# EAGLE design tinyI2C (EAGLE 6.5.0)
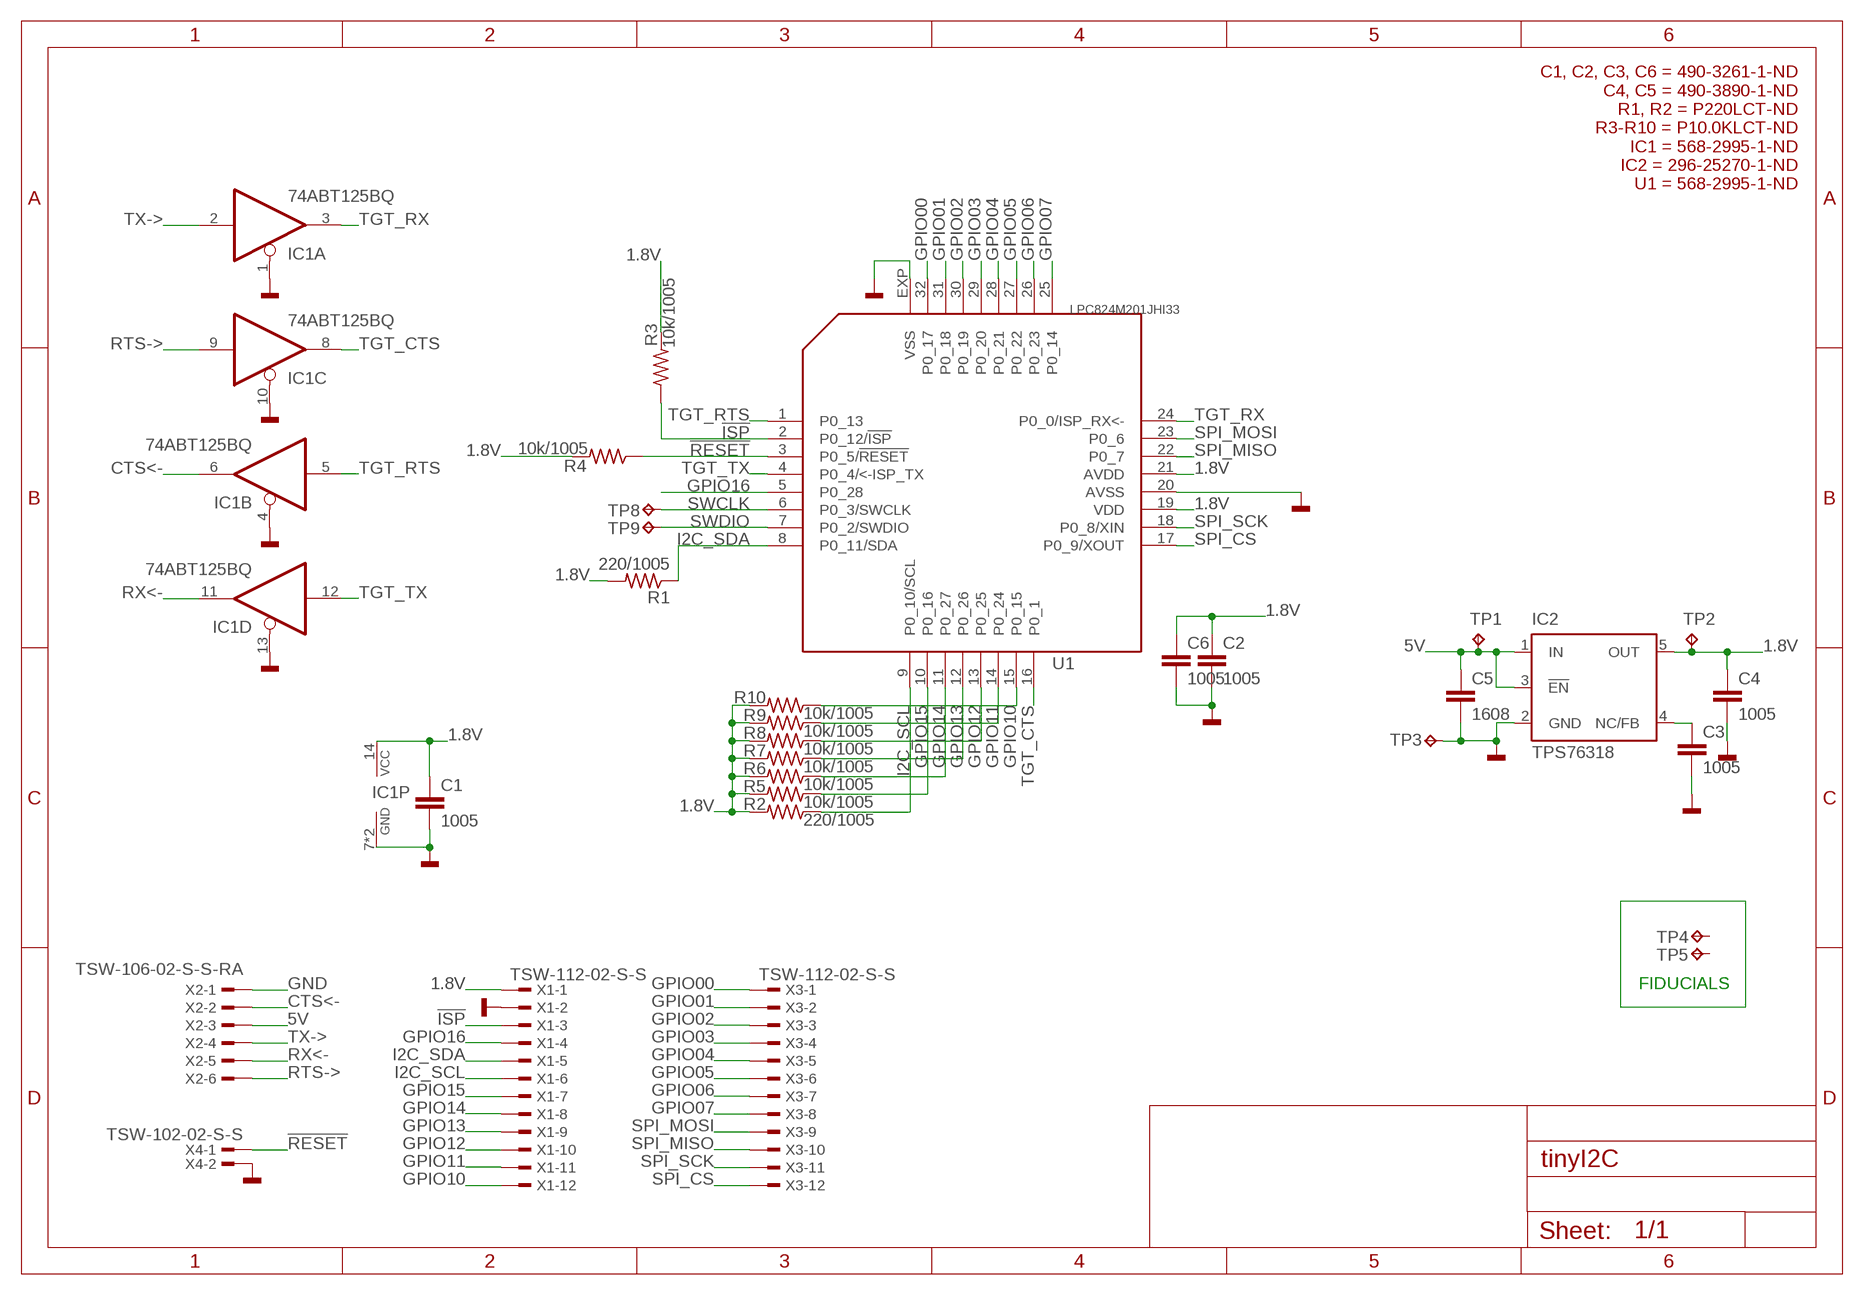
[diagram p0: schematic, sheet 1]

## Parts
C1  1005  C-EUC1005  [C1005]
C2  1005  C-EUC1005  [C1005]
C3  1005  C-EUC1005  [C1005]
C4  1005  C-EUC1005  [C1005]
C5  1608  C-EUC1608  [C1608]
C6  1005  C-EUC1005  [C1005]
IC1  74ABT125BQ  [DHVQFN14]
IC2  TPS76318  TPS77018  [SOT23-DBV]
R1  220/1005  R-US_R1005  [R1005]
R2  220/1005  R-US_R1005  [R1005]
R3  10k/1005  R-US_R1005  [R1005]
R4  10k/1005  R-US_R1005  [R1005]
R5  10k/1005  R-US_R1005  [R1005]
R6  10k/1005  R-US_R1005  [R1005]
R7  10k/1005  R-US_R1005  [R1005]
R8  10k/1005  R-US_R1005  [R1005]
R9  10k/1005  R-US_R1005  [R1005]
R10  10k/1005  R-US_R1005  [R1005]
TP1  TPTP07R  [TP07R]
TP2  TPTP07R  [TP07R]
TP3  TPTP07R  [TP07R]
TP4  TPTP10R  [TP10R]
TP5  TPTP10R  [TP10R]
TP8  TPTP07R  [TP07R]
TP9  TPTP07R  [TP07R]
U1  LPC824M201JHI33  [HVQFN33]
X1  TSW-112-02-S-S  [TSW-112-02-S-S]
X2  TSW-106-02-S-S-RA  [TSW-106-02-S-S-RA]
X3  TSW-112-02-S-S  [TSW-112-02-S-S]
X4  TSW-102-02-S-S  [TSW-102-02-S-S]

## Nets
1.8V: C1.1 C2.1 C4.1 C6.1 IC1.14(P:VCC) IC2.5(OUT) R1.2 R2.2 R3.2 R4.2 R5.2 R6.2 R7.2 R8.2 R9.2 R10.2 TP2.TP U1.19(VDD) U1.21(AVDD) X1.1
5V: C5.1 IC2.1(IN) IC2.3(!EN) TP1.TP X2.3
!ISP!: R3.1 U1.2(P0_12/!ISP!) X1.3
!RESET!: R4.1 U1.3(P0_5/!RESET!) X4.1
CTS<-: IC1.6(B:O) X2.2
GND: C1.2 C2.2 C3.2 C4.2 C5.2 C6.2 IC1.1(A:OE) IC1.4(B:OE) IC1.7(P:GND) IC1.10(C:OE) IC1.13(D:OE) IC1.EXP(P:GND) IC2.2(GND) TP3.TP U1.20(AVSS) U1.EXP(VSS) X1.2 X2.1 X4.2
GPIO00: U1.32(P0_17) X3.1
GPIO01: U1.31(P0_18) X3.2
GPIO02: U1.30(P0_19) X3.3
GPIO03: U1.29(P0_20) X3.4
GPIO04: U1.28(P0_21) X3.5
GPIO05: U1.27(P0_22) X3.6
GPIO06: U1.26(P0_23) X3.7
GPIO07: U1.25(P0_14) X3.8
GPIO10: R10.1 U1.15(P0_15) X1.12
GPIO11: R9.1 U1.14(P0_24) X1.11
GPIO12: R8.1 U1.13(P0_25) X1.10
GPIO13: R7.1 U1.12(P0_26) X1.9
GPIO14: R6.1 U1.11(P0_27) X1.8
GPIO15: R5.1 U1.10(P0_16) X1.7
GPIO16: U1.5(P0_28) X1.4
I2C_SCL: R2.1 U1.9(P0_10/SCL) X1.6
I2C_SDA: R1.1 U1.8(P0_11/SDA) X1.5
N$1: C3.1 IC2.4(NC/FB)
RTS->: IC1.9(C:I) X2.6
RX<-: IC1.11(D:O) X2.5
SPI_CS: U1.17(P0_9/XOUT) X3.12
SPI_MISO: U1.22(P0_7) X3.10
SPI_MOSI: U1.23(P0_6) X3.9
SPI_SCK: U1.18(P0_8/XIN) X3.11
SWCLK: TP8.TP U1.6(P0_3/SWCLK)
SWDIO: TP9.TP U1.7(P0_2/SWDIO)
TGT_CTS: IC1.8(C:O) U1.16(P0_1)
TGT_RTS: IC1.5(B:I) U1.1(P0_13)
TGT_RX: IC1.3(A:O) U1.24(P0_0/ISP_RX<-)
TGT_TX: IC1.12(D:I) U1.4(P0_4/<-ISP_TX)
TX->: IC1.2(A:I) X2.4
Unconnected: TP4.TP TP5.TP

## Notes on the sheet
- C1, C2, C3, C6 = 490-3261-1-ND
  C4, C5 = 490-3890-1-ND
  R1, R2 = P220LCT-ND
  R3-R10 = P10.0KLCT-ND
  IC1 = 568-2995-1-ND
  IC2 = 296-25270-1-ND
  U1 = 568-2995-1-ND
- FIDUCIALS

## Library data of the parts
C1-C6 = rcl:C-EU: CAPACITOR, European symbol
IC1 = 74xx-eu_local:74*125: Quad bus BUFFER, 3-state
IC2 = texas:TPS770*: ULTRALOW-POWER 50-mA LOW-DROPOUT LINEAR REGULATORS 50-mA Low-Dropout Regulator Source: http://focus.ti.com/lit/ds/symlink/tps77001.pdf; MF: TEXAS INSTRUMENT CONNECTORS; MPN: TPS77018DBVR; OC_FARNELL: 1575745; OC_NEWARK: 77C1176
R1-R10 = rcl:R-US_: RESISTOR, American symbol
TP1-TP5 TP8 TP9 = testpad:TP: Test pad
U1 = mbed-HDK:LPC824M201JHI33
X1 X3 = con-samtec.local:TSW-112-02-S-S: THROUGH-HOLE .025" SQ POST HEADER Source: Samtec TSW.pdf; OC_FARNELL: unknown; OC_NEWARK: unknown
X2 = con-samtec.local:TSW-106-02-S-S: THROUGH-HOLE .025" SQ POST HEADER Source: Samtec TSW.pdf; OC_FARNELL: unknown; OC_NEWARK: unknown
X4 = con-samtec.local:TSW-102-02-S-S: THROUGH-HOLE .025" SQ POST HEADER Source: Samtec TSW.pdf; OC_FARNELL: unknown; OC_NEWARK: unknown

## Net classes
0 default: clearance 0.2 mm
1 power: clearance 0.2 mm

## Board
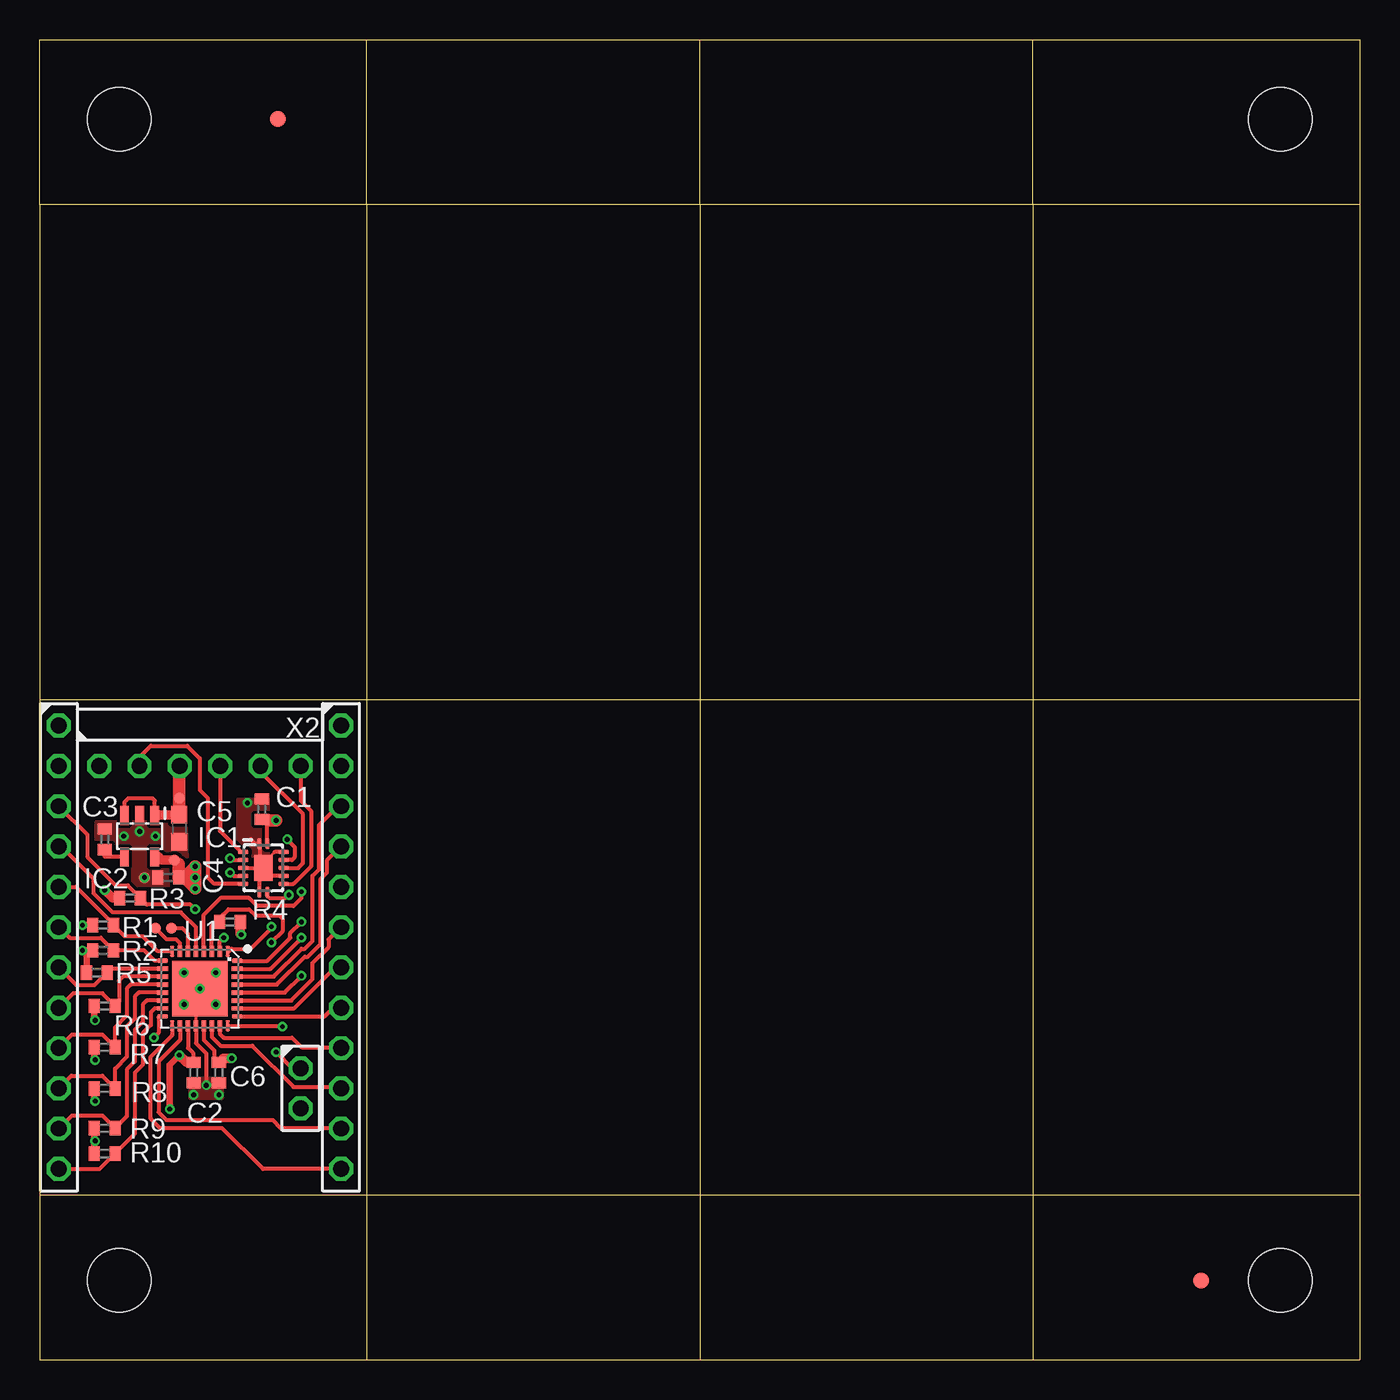
[diagram p1: board, top side]
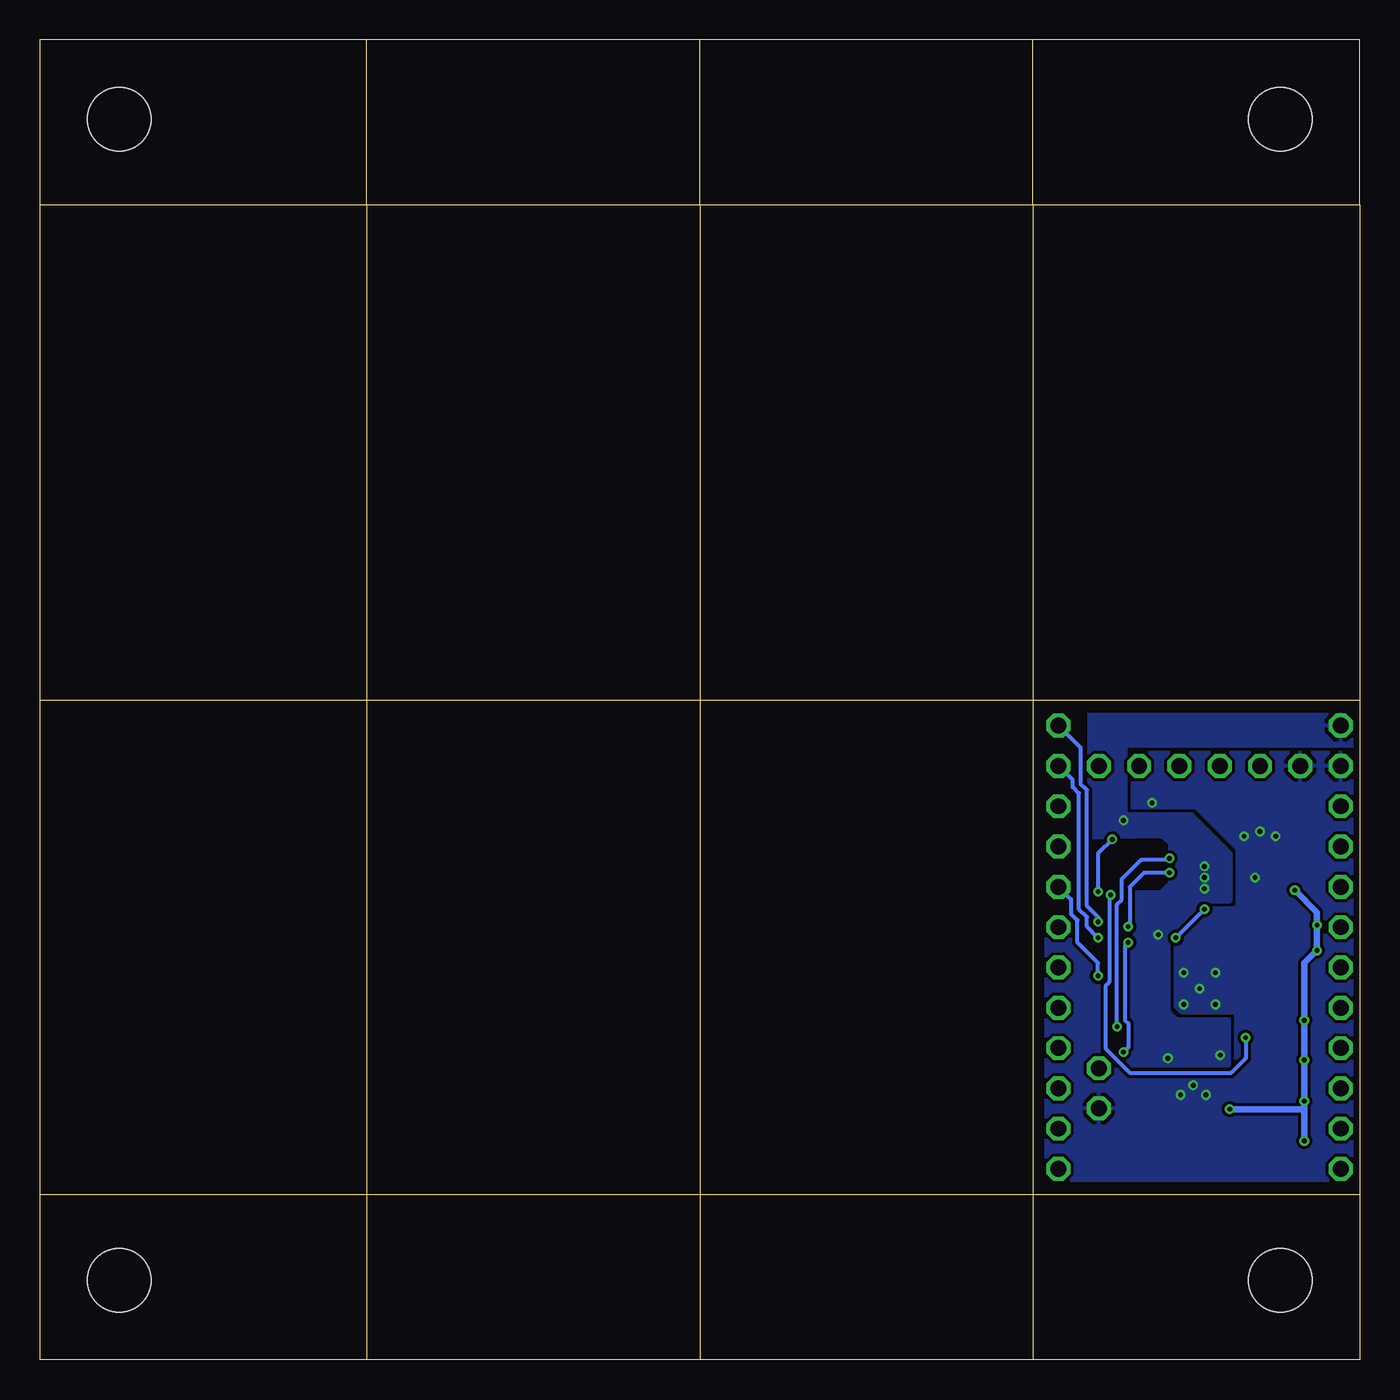
[diagram p2: board, bottom side, seen from below]

Size 83.2 x 83.2 mm. Coordinates in mm from the lower left corner, seen from the top.
Outline: 0,10.4 20.6,10.4
Outline: 20.6,10.4 41.6,10.4
Outline: 41.6,10.4 62.6,10.4
Outline: 62.6,10.4 83.2,10.4
Outline: 83.2,72.8 62.6,72.8
Outline: 62.6,72.8 41.6,72.8
Outline: 41.6,72.8 20.6,72.8
Outline: 20.6,72.8 0,72.8
Outline: 0,72.8 0,41.6
Outline: 0,41.6 0,10.4
Outline: 83.2,72.8 83.2,41.6
Outline: 83.2,41.6 83.2,10.4
Outline: 20.6,72.8 20.6,41.6
Outline: 20.6,41.6 20.6,10.4
Outline: 20.6,41.6 0,41.6
Outline: 41.6,72.8 41.6,41.6
Outline: 41.6,41.6 20.6,41.6
Outline: 41.6,41.6 41.6,10.4
Outline: 62.6,41.6 41.6,41.6
Outline: 62.6,72.8 62.6,41.6
Outline: 83.2,41.6 62.6,41.6
Outline: 62.6,41.6 62.6,10.4
Outline: 0,72.8 0,83.2 20.6,83.2
Outline: 20.6,83.2 41.6,83.2
Outline: 41.6,83.2 62.6,83.2
Outline: 62.6,83.2 83.2,83.2 83.2,72.8
Outline: 83.2,10.4 83.2,0 62.6,0
Outline: 20.6,0 0,0 0,10.4
Outline: 20.6,0 41.6,0
Outline: 41.6,0 62.6,0
Outline: 20.6,72.8 20.6,83.2
Outline: 41.6,72.8 41.6,83.2
Outline: 62.6,72.8 62.6,83.2
Outline: 62.6,10.4 62.6,0
Outline: 41.6,10.4 41.6,0
Outline: 20.6,10.4 20.6,0
Copper layers (1*16): Top 0.035mm / dielectric 1.5mm / Bottom 0.035mm
Design rules "default *": minimum track width 0.15mm, minimum drill 0.3mm, track to track 0.15mm, track to pad 0.15mm, pad to pad 0.15mm, via to via 0.15mm, smd to smd 0mil, copper to edge 0.4mm, drill to drill 8mil, minimum pad ring 0.15mm, minimum via ring 0.15mm, stop-mask expansion 4mil, vias tented up to drill 100mil, thermal gap 10mil
Holes 4 mm at 5,78.2 78.2,5 78.2,78.2 5,5
bRestrict: 4 lines

### Footprints (pad centres in the part's own frame; a part is rotated, then mirrored left to right if it is on the bottom)
C1005 = smd 0.7 x 0.9: 1 -0.65,0; 2 0.65,0
C1608 = smd 1.1 x 1: 1 -0.85,0; 2 0.85,0
DHVQFN14 = smd 0.7 x 0.28: 1 -1.525,-0.25; 7 1.525,-0.25; 8 1.525,0.25; 14 -1.525,0.25 | smd 0.28 x 0.7: 2 -1,-1.275; 3 -0.5,-1.275; 4 0,-1.275; 5 0.5,-1.275; 6 1,-1.275; 9 1,1.275; 10 0.5,1.275; 11 0,1.275; 12 -0.5,1.275; 13 -1,1.275 | smd 1.65 x 1.15: EXP 0,0
SOT23-DBV = smd 0.55 x 1.2: 1 -0.95,-1.3; 2 0,-1.3; 3 0.95,-1.3; 4 0.95,1.3; 5 -0.95,1.3
R1005 = smd 0.7 x 0.9: 1 -0.65,0; 2 0.65,0
TP07R = smd 0.7 x 0.7: TP 0,0
TP10R = smd 1 x 1: TP 0,0
HVQFN33 = smd 0.7 x 0.28: 1 -2.35,1.75; 2 -2.35,1.25; 3 -2.35,0.75; 4 -2.35,0.25; 5 -2.35,-0.25; 6 -2.35,-0.75; 7 -2.35,-1.25; 8 -2.35,-1.75; 17 2.35,-1.75; 18 2.35,-1.25; 19 2.35,-0.75; 20 2.35,-0.25; 21 2.35,0.25; 22 2.35,0.75; 23 2.35,1.25; 24 2.35,1.75 | smd 0.28 x 0.7: 9 -1.75,-2.35; 10 -1.25,-2.35; 11 -0.75,-2.35; 12 -0.25,-2.35; 13 0.25,-2.35; 14 0.75,-2.35; 15 1.25,-2.35; 16 1.75,-2.35; 25 1.75,2.35; 26 1.25,2.35; 27 0.75,2.35; 28 0.25,2.35; 29 -0.25,2.35; 30 -0.75,2.35; 31 -1.25,2.35; 32 -1.75,2.35 | smd 3.5 x 3.5: EXP 0,0
TSW-112-02-S-S = drill 1 pad 1.5 octagon: 1 13.97,0; 2 11.43,0; 3 8.89,0; 4 6.35,0; 5 3.81,0; 6 1.27,0; 7 -1.27,0; 8 -3.81,0; 9 -6.35,0; 10 -8.89,0; 11 -11.43,0; 12 -13.97,0
TSW-106-02-S-S-RA = drill 1 pad 1.5 octagon: 1 6.35,1.524; 2 3.81,1.524; 3 1.27,1.524; 4 -1.27,1.524; 5 -3.81,1.524; 6 -6.35,1.524
TSW-102-02-S-S = drill 1 pad 1.5 octagon: 1 1.27,0; 2 -1.27,0

### Placement (x,y rotation side)
C1  14,34.7 90 top
C2  9.7,18.1 270 top
C3  4.1,32.8 90 top
C4  8.1,30.4 180 top
C5  8.8,33.5 270 top
C6  11.3,18.1 270 top
IC1  14.1,31 270 top
IC2  6.3,33 180 top
R1  4,27.4 180 top
R2  4,25.8 180 top
R3  5.7,29.1 180 top
R4  12,27.6 0 top
R5  3.6,24.4 180 top
R6  4.1,22.3 180 top
R7  4.1,19.7 180 top
R8  4.1,17.1 180 top
R9  4.1,14.6 180 top
R10  4.1,13 180 top
TP1  8.8,35.4 0 top
TP2  8.5,31.5 0 top
TP3  6.6,30.4 0 top
TP4  15,78.2 0 top
TP5  73.2,5 0 top
TP8  8.3,27.2 0 top
TP9  7.3,27.2 0 top
U1  10.1,23.4 270 top
X1  1.21,26 90 top
X2  10.1,38.95 180 top
X3  18.99,26 90 top
X4  16.45,17.11 90 top

### Tracks (layer width: path | path; a pad name or v marks a point on that pad's centre or on a via)
1.8V  (via drill 0.3, 0.3 pad 0.6)
  Top 0.25: U1.21 10.35,20.15 11,19.5 11,19.05 C6.1 | U1.19 9.35,19.65 9.7,19.3 C2.1 | IC1.14 14.35,33.7 C1.1
  Top 0.4: IC2.5 7.5,31.7 | R6.2 3.45,21.45 v3.5,21.4 | R7.2 3.45,18.95 v3.5,18.9 | R8.2 3.45,16.35 v3.5,16.3 | R9.2 3.45,13.85 v3.5,13.8 3.45,13.75 R10.2 | R5.2 2.95,25.55 v2.7,25.8 R2.2 | R1.2 v2.7,27.4 | v8.2,15.8 8.2,18.6 v8.8,19.2
  Top 0.6: C4.1 9.1,30.4 | 8.75,31.25 TP2.TP 7.7,31.5 7.5,31.7 | R4.2 12.65,26.85 v12.7,26.8 | R3.2 4.6,29.1 v4.1,29.6 | v12.1,19 11.55,19 C6.1 | C2.1 9.25,18.75 v8.8,19.2 | 14.5,34 14,34 C1.1
  Top 0.8: 8.75,31.25 C4.1 | v14.9,34 14.5,34 | v9.8,31.1 v9.8,30.4 v9.8,29.7 9.1,30.4 v9.8,31.1
  Bottom 0.4: v3.5,13.8 3.5,15.8 | 3.5,15.8 v3.5,16.3 v3.5,18.9 v3.5,21.4 3.5,25 v2.7,25.8 v2.7,27.4 2.7,28.2 v4.1,29.6 | v8.2,15.8 3.5,15.8
  pour Bottom: 8.1,31.9 10.6,34.4 14.7,34.4 14.7,38.7 -0.5,38.7 -0.5,41.4 17.1,41.4 17.1,32.9 12.5,33 12,32.5 12,30.1 12.6,29.5 15,29.5 15,19 14,18 8.2,18 8.2,21.5 11.5,21.5 12,22 12,26.5 9.6,28.9 8.1,28.9
5V
  Top 0.25: IC2.1 7.25,35.25 7.1,35.4 5.6,35.4 5.35,35.15 IC2.3
  Top 0.6: C5.1 7.3,34.35 IC2.1
  Top 0.8: X2.3 8.8,36.85 TP1.TP C5.1
!ISP!  (via drill 0.3)
  Top 0.25: U1.2 11.35,26.35 v11.6,26.6 | v9.8,28.4 9.5,28.7 6.75,28.7 R3.1 5.55,29.9 4.8,29.9 3,31.7 3,33.1 X1.3
  Bottom 0.25: v11.6,26.6 v9.8,28.4
!RESET!  (via drill 0.3)
  Top 0.25: U1.3 10.85,27.35 11.1,27.6 R4.1 11.35,27.85 11.9,28.4 13.2,28.4 13.6,28 15.1,28 15.3,27.8 15.3,27 v14.6,26.3 | v14.9,19.4 15.92,18.38 X4.1
  Bottom 0.25: v14.6,26.3 14.8,26.1 14.8,21.4 14.6,21.2 14.6,19.7 v14.9,19.4
CTS<-
  Top 0.25: X2.2 6.29,37.99 7,38.7 9.3,38.7 10.1,37.9 10.1,35.9 10.6,35.4 10.6,30.4 11,30 IC1.6
GND  (via drill 0.3)
  Top 0.2: U1.20 9.85,23.15 U1.EXP | 14.8,32 14.5,31.7
  Top 0.25: 14.5,31.7 14.5,31.4 IC1.EXP | IC1.EXP 14.6,30.5 IC1.10 | U1.20 9.85,19.95 10.5,19.3 v10.5,17.3 | IC1.4 IC1.EXP | IC1.13 14.8,32 | IC1.EXP 13.85,31.25 IC1.1 13.57,32.52 13.3,32.8 | IC1.7 13.85,30.75 IC1.EXP
  other vias: 13.1,35.1 11.1,22.4 11.1,24.4 9.1,24.4 9.1,22.4 10.1,23.4 6.3,33.3 6.6,30.4 7.3,33 5.3,33 9.7,16.7 11.3,16.7
  pour Bottom (rank 2): 0,41.2 20.2,41.2 20.2,10.8 0,10.8
  pour Top (no thermals): 3.6,33.9 9.2,33.9 9.3,29.9 5.9,29.9 5.9,31.4 3.6,31.4
  pour Top (rank 2, no thermals): 9.5,17.7 9.5,16.5 11.5,16.5 11.5,17.7
  pour Top (rank 2, no thermals): 12.5,31.8 14.4,31.8 14.4,35.3 12.5,35.3
GPIO00  (via drill 0.3 pad 0.6)
  Top 0.25: U1.32 14.35,25.15 15.8,26.6 15.8,26.9 v16.5,27.6
  Bottom 0.25: v16.5,27.6 16.5,27.9 17.2,28.6 17.2,35.9 17.6,36.3 17.6,38.58 X3.1
GPIO01  (via drill 0.3)
  Top 0.25: U1.31 14.55,24.65 v16.5,26.6
  Bottom 0.25: v16.5,26.6 17.2,27.3 17.2,27.9 17.7,28.4 17.7,35.7 18.1,36.1 18.1,36.54 X3.2
GPIO02
  Top 0.25: X3.3 18.79,34.89 17.6,33.7 17.6,30.9 17.2,30.5 17.2,26.4 16.7,25.9 16.5,25.9 14.75,24.15 U1.30
GPIO03
  Top 0.25: U1.29 14.95,23.65 16.7,25.4 16.9,25.4 17.7,26.2 17.7,30.3 18.1,30.7 18.1,31.46 X3.4
GPIO04  (via drill 0.3 pad 0.6)
  Top 0.25: U1.28 15.45,23.15 v16.5,24.2
  Bottom 0.25: v16.5,24.2 16.5,25 17.8,26.3 17.8,27.7 18.2,28.1 18.2,29.02 X3.5
GPIO05
  Top 0.25: U1.27 15.85,22.65 17.2,24 17.2,25 18.2,26 18.2,26.48 X3.6
GPIO06
  Top 0.25: X3.7 18.63,24.73 16.05,22.15 U1.26
GPIO07
  Top 0.25: U1.25 17.95,21.65 18.49,22.19 X3.8
GPIO10
  Top 0.25: U1.15 7.25,22.15 7,21.9 7,21.1 6.5,20.6 6.5,18.6 6,18.1 6,14.25 R10.1 3.78,12.03 X1.12
GPIO11
  Top 0.25: U1.14 6.75,22.65 6.5,22.4 6.5,21.3 6,20.8 6,18.8 5.5,18.3 5.5,15.35 R9.1 3.95,15.4 2.04,15.4 X1.11
GPIO12
  Top 0.25: U1.13 6.25,23.15 6,22.9 6,21.5 5.5,21 5.5,19.1 4.75,18.35 R8.1 3.95,17.9 2,17.9 X1.10
GPIO13
  Top 0.25: U1.12 5.75,23.65 5.5,23.4 5.5,21.7 4.75,20.95 R7.1 3.95,20.5 2.06,20.5 X1.9
GPIO14
  Top 0.25: U1.11 5.25,24.15 5,23.9 5,22.55 R6.1 3.95,23.1 2.12,23.1 X1.8
GPIO15
  Top 0.25: U1.10 4.5,24.65 R5.1 3.45,23.6 2.34,23.6 X1.7
GPIO16
  Top 0.25: U1.5 9.85,27.25 8.9,28.2 4.6,28.2 3.4,29.4 3.4,30.3 1.35,32.35 X1.4
I2C_SCL
  Top 0.25: U1.9 7.25,25.15 6.6,25.8 R2.1 3.85,26.6 1.9,26.6 1.23,27.27 X1.6
I2C_SDA
  Top 0.25: U1.8 7.45,25.75 6.5,26.7 5.35,26.7 R1.1 4.7,27.4 2.29,29.81 X1.5
N$1
  Top 0.25: IC2.4 4.1,31.7 C3.1
RTS->
  Top 0.25: X2.6 16.45,35.25 17.1,34.6 17.1,31.1 16,30 IC1.9
RX<-
  Top 0.25: X2.5 13.91,37.09 16.6,34.4 16.6,31.3 16.3,31 IC1.11
SPI_CS
  Top 0.25: U1.17 8.35,20.45 7,19.1 7,15.2 7.6,14.6 11.5,14.6 14.07,12.03 X3.12
SPI_MISO
  Top 0.25: U1.22 10.85,20.35 11.4,19.8 13.4,19.8 16,17.2 18.9,17.2 X3.10
SPI_MOSI
  Top 0.25: U1.23 11.35,20.55 11.6,20.3 15.9,20.3 16.5,19.7 18.94,19.7 X3.9
SPI_SCK
  Top 0.25: U1.18 8.85,20.15 7.5,18.8 7.5,15.6 8,15.1 14.7,15.1 15.2,14.6 18.9,14.6 18.93,14.57 X3.11
SWCLK
  Top 0.25: U1.6 9.35,26.85 9,27.2 TP8.TP
SWDIO
  Top 0.25: U1.7 8.85,26.25 8.6,26.5 8,26.5 TP9.TP
TGT_CTS  (via drill 0.3, 0.3 pad 0.6)
  Top 0.25: v15.7,29.3 15.5,29.1 14.5,29.1 14.35,29.25 IC1.8 | U1.16 7.55,21.65 7.5,21.6 7.5,20.6 v7.2,20.3
  Bottom 0.25: v15.7,29.3 15.8,29.2 15.8,23.8 16,23.6 16,19.6 14.5,18.1 8.1,18.1 7.2,19 v7.2,20.3
TGT_RTS  (via drill 0.3)
  Top 0.25: v12,30.7 12.2,30.5 IC1.5 | U1.1 11.95,25.75 12.1,25.9 13.3,25.9 14.6,27.2 v14.6,27.3
  Bottom 0.25: v12,30.7 13.6,30.7 14.5,29.8 14.5,27.4 v14.6,27.3
TGT_RX  (via drill 0.3)
  Top 0.25: v12,31.6 12.2,31.5 IC1.3 | U1.24 15.25,21.05 v15.3,21
  Bottom 0.25: v15.3,21 15.3,28.7 15,29 15,30.3 13.8,31.5 12.1,31.5 v12,31.6
TGT_TX  (via drill 0.3, 0.3 pad 0.6)
  Top 0.25: U1.4 10.35,28.05 11.4,29.1 13.2,29.1 13.7,28.6 16,28.6 16.5,29.1 v16.5,29.5 | v15.6,32.8 16.1,32.3 16.1,31.7 15.9,31.5 IC1.12
  Bottom 0.25: v15.6,32.8 16.5,31.9 v16.5,29.5
TX->
  Top 0.25: X2.4 11.37,33.33 12.7,32 IC1.2